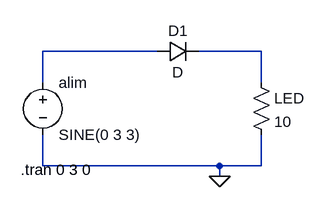
[diagram p0: schematic LED rouge.asc]
LED rouge.asc, the LTspice schematic file:
Version 4
SHEET 1 880 680
WIRE 160 80 -16 80
WIRE 320 80 224 80
WIRE -16 128 -16 80
WIRE 320 128 320 80
WIRE -16 256 -16 208
WIRE 256 256 -16 256
WIRE 320 256 320 208
WIRE 320 256 256 256
WIRE 256 272 256 256
FLAG 256 272 0
SYMBOL voltage -16 112 R0
WINDOW 123 0 0 Left 0
WINDOW 39 0 0 Left 0
SYMATTR InstName alim
SYMATTR Value SINE(0 3 3)
SYMBOL diode 160 96 R270
WINDOW 0 32 32 VTop 2
WINDOW 3 0 32 VBottom 2
SYMATTR InstName D1
SYMBOL res 304 112 R0
SYMATTR InstName LED
SYMATTR Value 10
TEXT -50 262 Left 2 !.tran 0 3 0

The netlist it stands for:
* LED rouge.asc
V§alim N001 0 SINE(0 3 3)
D1 N001 N002 D
R§LED N002 0 10
.model D D
.lib standard.dio
.tran 0 3 0
.backanno
.end